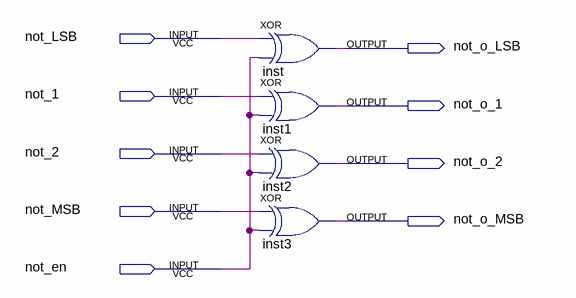
[diagram p0: schematic sheet]
// Quartus schematic 4bit_conditional_not.bdf as structural Verilog: 4 symbols, 9 pins
module \4bit_conditional_not  (
  input  not_LSB,
  input  not_1,
  input  not_2,
  input  not_MSB,
  input  not_en,
  output not_o_LSB,
  output not_o_1,
  output not_o_2,
  output not_o_MSB
);

  xor inst (not_o_LSB, not_LSB, not_en);
  xor inst1 (not_o_1, not_1, not_en);
  xor inst2 (not_o_2, not_2, not_en);
  xor inst3 (not_o_MSB, not_MSB, not_en);
endmodule
